# Altium schematic sheet loadswitch.SchDoc
size A
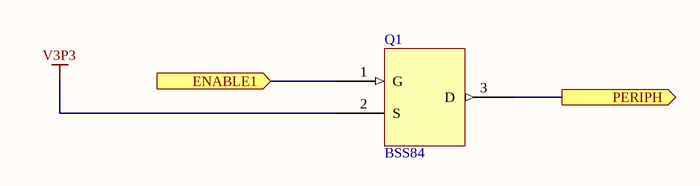
[diagram p0: loadswitch.SchDoc]

## Parts
Q1  BSS84  [TRANSISTOR]

## Ports
ENABLE1 (in), PERIPH (out)

## Nets
V3P3: Q1.2(S)
ENABLE1: Q1.1(G) ; port ENABLE1
PERIPH: Q1.3(D) ; port PERIPH

## Library data of the parts
Q1 = BSS84: Transistor; Fabricant: DIODES INC.; Ref. Fabricant: BSS84-7-F; Fournisseur: Farnell; Ref. Fournisseur: 1843716